# EAGLE schematic ESP_LoRa_Battery (EAGLE 9.6.0)
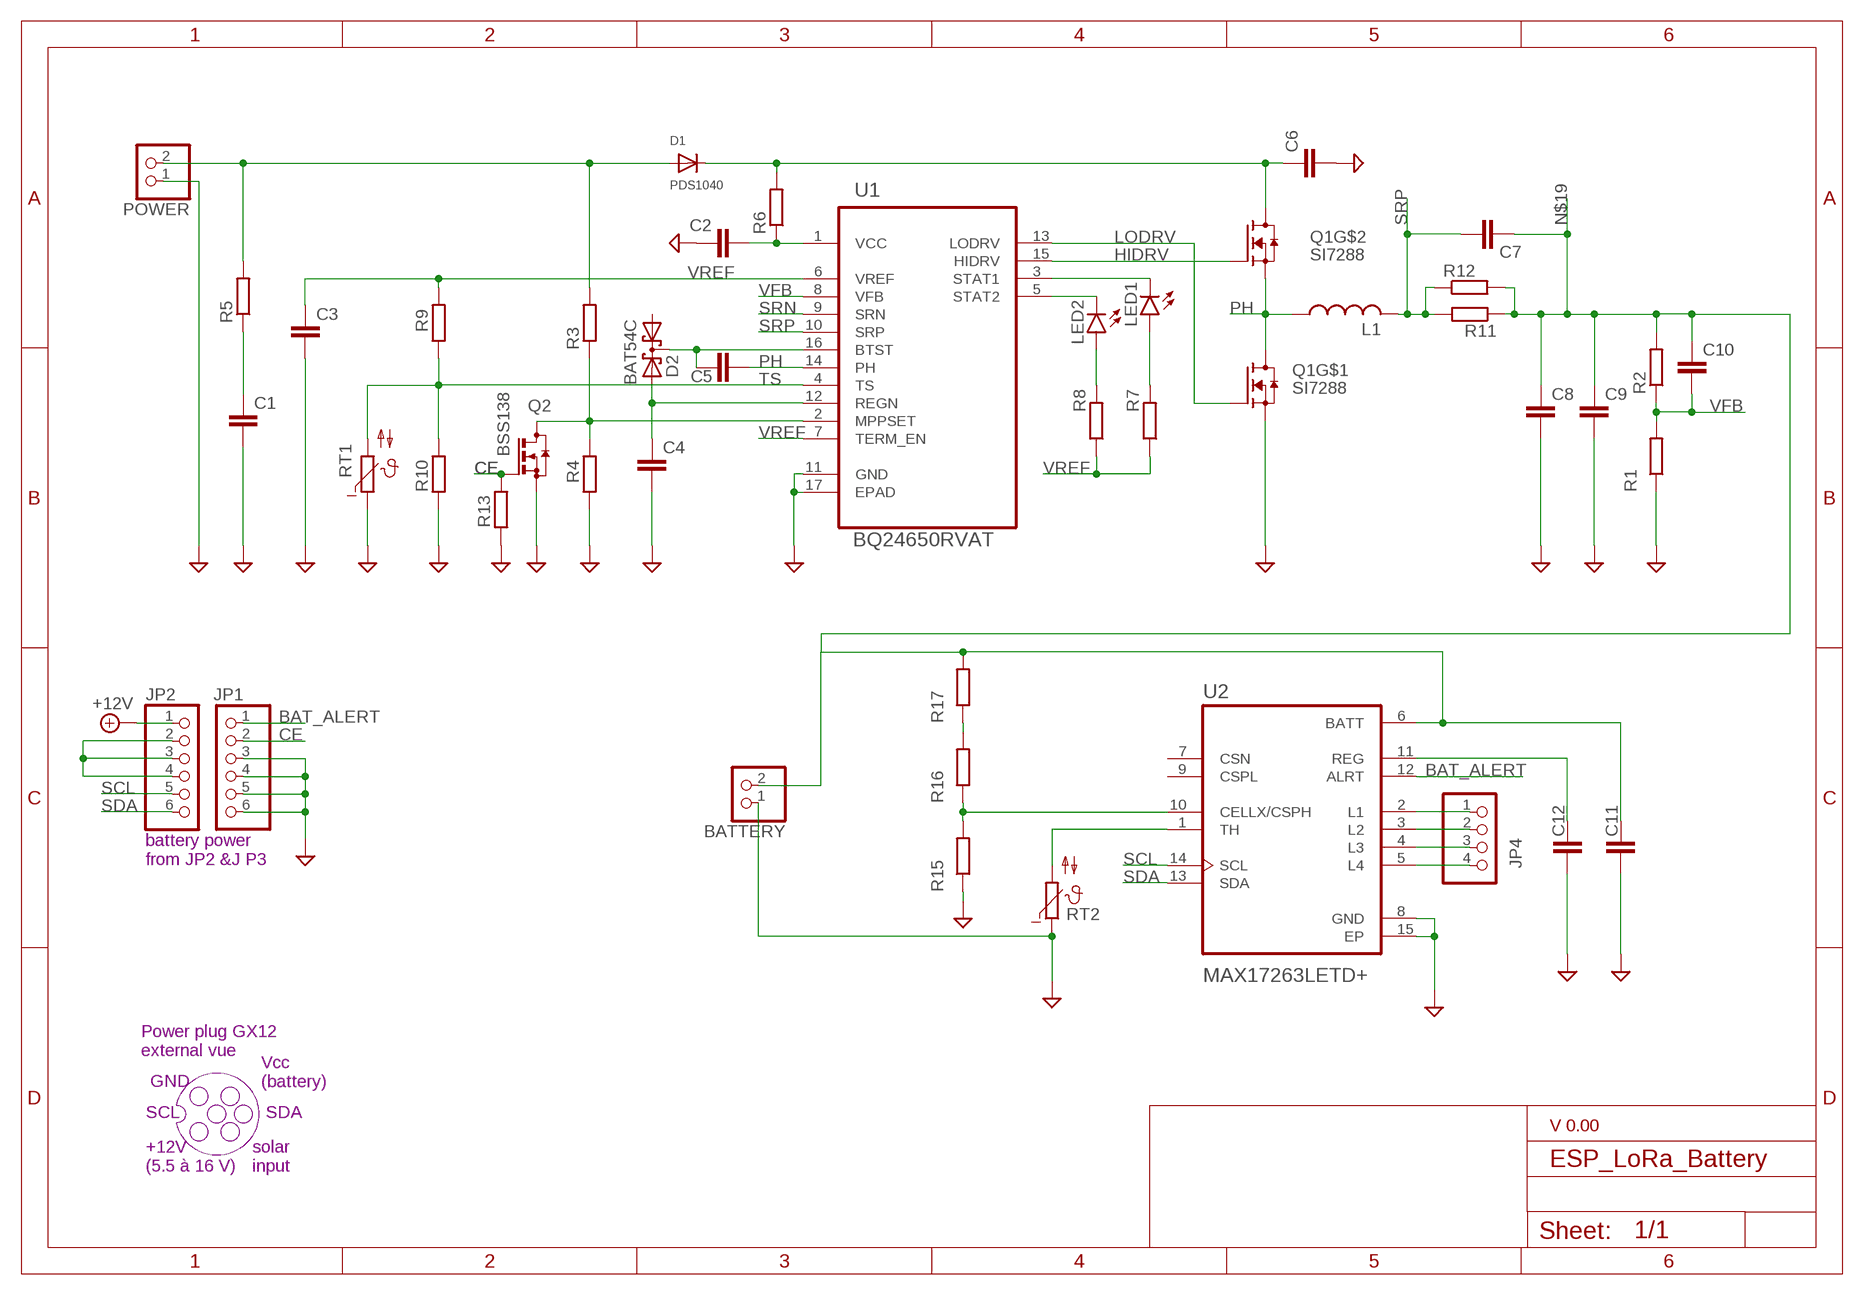
[diagram p0: schematic, sheet 1]

## Parts
BATTERY  PINHD-1X2  [1X02]
C1  C-EUC1206K  [C1206K]
C2  C-EUC1206K  [C1206K]
C3  C-EUC1206K  [C1206K]
C4  C-EUC1206K  [C1206K]
C5  C-EUC0805K  [C0805K]
C6  C-EUC1206K  [C1206K]
C7  C-EUC0805K  [C0805K]
C8  C-EUC1206K  [C1206K]
C9  C-EUC1206K  [C1206K]
C10  C-EUC1206K  [C1206K]
C11  C-EUC0805K  [C0805K]
C12  C-EUC0805K  [C0805K]
D1  PDS1040  [DIO_SBR10U200P5-13]
D2  BAT54C  [SOT23]
JP1  PINHD-1X6  [1X06]
JP2  PINHD-1X6  [1X06]
JP4  PINHD-1X4  [1X04]
L1  L-USL2825P  [L2825P]
LED1  LEDSMT1206  [1206]
LED2  LEDSMT1206  [1206]
POWER  PINHD-1X2  [1X02]
Q1  SI7288  SI7288DP-T1-GE3  [TRANS_SI7288DP-T1-GE3]
Q2  BSS138  [SOT23]
R1  R-EU_R0805  [R0805]
R2  R-EU_R0805  [R0805]
R3  R-EU_R0805  [R0805]
R4  R-EU_R0805  [R0805]
R5  R-EU_R2512  [R2512]
R6  R-EU_R1206  [R1206]
R7  RR1206  [R1206]
R8  RR1206  [R1206]
R9  R-EU_R0805  [R0805]
R10  R-EU_R0805  [R0805]
R11  R-EU_R2512  [R2512]
R12  R-EU_R2512  [R2512]
R13  R-EU_R0805  [R0805]
R15  R-EU_R0805  [R0805]
R16  R-EU_R0805  [R0805]
R17  R-EU_R0805  [R0805]
RT1  NTC642-6  [P642]
RT2  NTC642-6  [P642]
U1  BQ24650RVAT  [QFN50P350X350X100-17N]
U2  MAX17263LETD+  [SON40P300X300X80-15N]

## Nets
3.3_BAT: JP2.2 JP2.3 JP2.4
+12V: JP2.1
BAT_ALERT: JP1.1 U2.12(ALRT)
CE: JP1.2 Q2.1(G) R13.2
GND: BATTERY.1 C1.2 C2.2 C3.2 C4.2 C6.2 C8.2 C9.2 C11.2 C12.2 JP1.3 JP1.4 JP1.5 JP1.6 POWER.1 Q1.1(S1) Q2.2(S) R1.1 R4.1 R10.1 R13.1 R15.1 RT1.1 RT2.1 U1.11(GND) U1.17(EPAD) U2.8(GND) U2.15(EP)
HIDRV: Q1.4(G2) U1.15(HIDRV)
LODRV: Q1.2(G1) U1.13(LODRV)
N$1: LED1.C U1.3(STAT1)
N$2: LED2.C U1.5(STAT2)
N$3: JP4.1 U2.2(L1)
N$4: JP4.2 U2.3(L2)
N$5: JP4.3 U2.4(L3)
N$6: JP4.4 U2.5(L4)
N$7: LED1.A R7.2
N$8: LED2.A R8.2
N$9: C5.1 D2.3(K1K2) U1.16(BTST)
N$10: C4.1 D2.2(A2) U1.12(REGN)
N$11: R15.2 R16.1 U2.10(CELLX/CSPH)
N$12: Q2.3(D) R3.1 R4.2 U1.2(MPPSET)
N$13: D1.2(A) D1.3(A) POWER.2 R3.2 R5.2
N$14: C6.1 D1.1(C) Q1.5(D2) Q1.6(D2) Q1.10(D2) R6.2
N$15: C2.1 R6.1 U1.1(VCC)
N$16: C1.1 R5.1
N$17: C12.1 U2.11(REG)
N$18: RT2.2 U2.1(TH)
N$19: BATTERY.2 C7.2 C8.1 C9.1 C10.1 C11.1 R2.2 R11.1 R12.2 R17.2 U2.6(BATT)
N$21: R16.2 R17.1
PH: C5.2 L1.1 Q1.3(S2) Q1.7(D1) Q1.8(D1) Q1.9(D1) U1.14(PH)
SCL: JP2.5 U2.14(SCL)
SDA: JP2.6 U2.13(SDA)
SRN: U1.9(SRN)
SRP: C7.1 L1.2 R11.2 R12.1 U1.10(SRP)
TS: R9.1 R10.2 RT1.2 U1.4(TS)
VFB: C10.2 R1.2 R2.1 U1.8(VFB)
VREF: C3.1 R7.1 R8.1 R9.2 U1.6(VREF) U1.7(TERM_EN)
Unconnected: D2.1(A1) U2.7(CSN) U2.9(CSPL)

## Notes on the sheet
- battery power
  from JP2 &J P3
- Power plug GX12
  external vue
- GND
- Vcc
  (battery)
- SCL | SDA
- V 0.00
- +12V
  (5.5 à 16 V)
- solar 
  input

## Library data of the parts
BATTERY POWER = pinhead:PINHD-1X2: PIN HEADER
C1-C12 = rcl:C-EU: CAPACITOR, European symbol; SPICEPREFIX: C
D1 = PDS1040:PDS1040; DESCRIPTION: Diode Schottky 40V 10A Surface Mount PowerDI™ 5; DIGI-KEY_PART_NUMBER: PDS1040LDICT-ND; DIGI-KEY_PURCHASE_URL: https://www.digikey.com/product-detail/en/diodes-incorporated/PDS1040L-13/PDS1040LDICT-ND/717938?utm_source=snapeda&utm_medium=aggregator&utm_campaign=symbol; MF: Diodes Inc.; MP: PDS1040; PACKAGE: PowerDI™-5 Diodes Inc.
D2 = nxp_60:BAT54C: Schottky barrier (double) diodes Planar Schottky barrier diodes encapsulated in a SOT23 small plastic SMD package. Single diodes and double diodes with different pinning are available. AAL Eindhoven MK
JP1 JP2 = pinhead:PINHD-1X6: PIN HEADER
JP4 = pinhead:PINHD-1X4: PIN HEADER
L1 = rcl:L-US: INDUCTOR, American symbol; SPICEPREFIX: L
LED1 LED2 = led:LED: LED OSRAM: - CHIPLED LG R971, LG N971, LY N971, LG Q971, LY Q971, LO R971, LY R971 LH N974, LH R974 LS Q976, LO Q976, LY Q976 LO Q996 - Hyper CHIPLED LW Q18S LB Q993, LB Q99A, LB R99A - SideLED LS A670, LO A670, LY A670, LG A670, LP A670 LB A673, LV A673, LT A673, LW A673 LH A674 LY A675 LS A676, LA A676, LO A676, LY A676, LW A676 LS A679, LY A679, LG A679 - Hyper Micro SIDELED® LS Y876, LA Y876, LO Y876, LY Y876 LT Y87S - SmartLED LW L88C, LW L88S LB L89C, LB L89S, LG L890 LS L89K, LO L89K, LY L89K LS L896, LA L896, LO L896, LY L896 - TOPLED LS T670, LO T670, LY T670, LG T670, LP T670 LSG T670, LSP T670, LSY T670, LOP T670, LYG T670 LG T671, LOG T671, LSG T671 LB T673, LV T673, LT T673, LW T673 LH T674 LS T676, LA T676, LO T676, LY T676, LB T676, LH T676, LSB T676, LW T676 LB T67C, LV T67C, LT T67C, LS T67K, LO T67K, LY T67K, LW E67C LS E67B, LA E67B, LO E67B, LY E67B, LB E67C, LV E67C, LT E67C LW T67C LS T679, LY T679, LG T679 LS T770, LO T770, LY T770, LG T770, LP T770 LB T773, LV T773, LT T773, LW T773 LH T774 LS E675, LA E675, LY E675, LS T675 LS T776, LA T776, LO T776, LY T776, LB T776 LHGB T686 LT T68C, LB T68C - Hyper Mini TOPLED® LB M676 - Mini TOPLED Santana® LG M470 LS M47K, LO M47K, LY M47K Source: http://www.osram.convergy.de LUXEON: - LUMILED® LXK2-PW12-R00, LXK2-PW12-S00, LXK2-PW14-U00, LXK2-PW14-V00 LXK2-PM12-R00, LXK2-PM12-S00, LXK2-PM14-U00 LXK2-PE12-Q00, LXK2-PE12-R00, LXK2-PE12-S00, LXK2-PE14-T00, LXK2-PE14-U00 LXK2-PB12-K00, LXK2-PB12-L00, LXK2-PB12-M00, LXK2-PB14-N00, LXK2-PB14-P00, LXK2-PB14-Q00 LXK2-PR12-L00, LXK2-PR12-M00, LXK2-PR14-Q00, LXK2-PR14-R00 LXK2-PD12-Q00, LXK2-PD12-R00, LXK2-PD12-S00 LXK2-PH12-R00, LXK2-PH12-S00 LXK2-PL12-P00, LXK2-PL12-Q00, LXK2-PL12-R00 Source: www.luxeon.com KINGBRIGHT: KA-3528ASYC Source: www.kingbright.com
Q1 = SI7288DP-T1-GE3:SI7288DP-T1-GE3: Dual N-Channel 40 V 0.019 Ohm Surface Mount Power Mosfet - PowerPAK SO-8; DESCRIPTION: Mosfet Array 2 N-Channel _Dual_ 40V 20A 15.6W Surface Mount PowerPAK® SO-8 Dual; DIGI-KEY_PART_NUMBER: SI7288DP-T1-GE3CT-ND; DIGI-KEY_PURCHASE_URL: https://www.digikey.com/product-detail/en/vishay-siliconix/SI7288DP-T1-GE3/SI7288DP-T1-GE3CT-ND/2442044?utm_source=snapeda&utm_medium=aggregator&utm_campaign=symbol; MF: Vishay; MP: SI7288DP-T1-GE3; PACKAGE: SO-8 Vishay
Q2 = detect:BSS138: N-CHANNEL MOS FET
R1-R6 R9-R13 R15-R17 = rcl:R-EU_: RESISTOR, European symbol; SPICEPREFIX: R
R7 R8 = eagle-ltspice:R: RESISTOR, European symbol; SPICEMODEL: NONE; SPICEPREFIX: R
RT1 RT2 = ptc-ntc:NTC642-6: PHILIPS NTC; OC_FARNELL: unknown; OC_NEWARK: unknown
U1 = BQ24650RVAT:BQ24650RVAT: Synchronous Switch-Mode Battery Charge Controller; AVAILABILITY: Unavailable; DESCRIPTION: Charger IC Multi-Chemistry 16-VQFN _3.5x3.5_; MF: Texas Instruments; MP: BQ24650RVAT; PACKAGE: VQFN-16 Texas Instruments; PRICE: None
U2 = MAX17263LETD_:MAX17263LETD+: None; AVAILABILITY: Unavailable; DESCRIPTION: IC FUEL GAUGE SINGL/MULTI 14TDFN; MF: Maxim Integrated; MP: MAX17263LETD+; PACKAGE: TDFN-14 Maxim; PRICE: None